# Altium schematic sheet 1.SchDoc
size A4
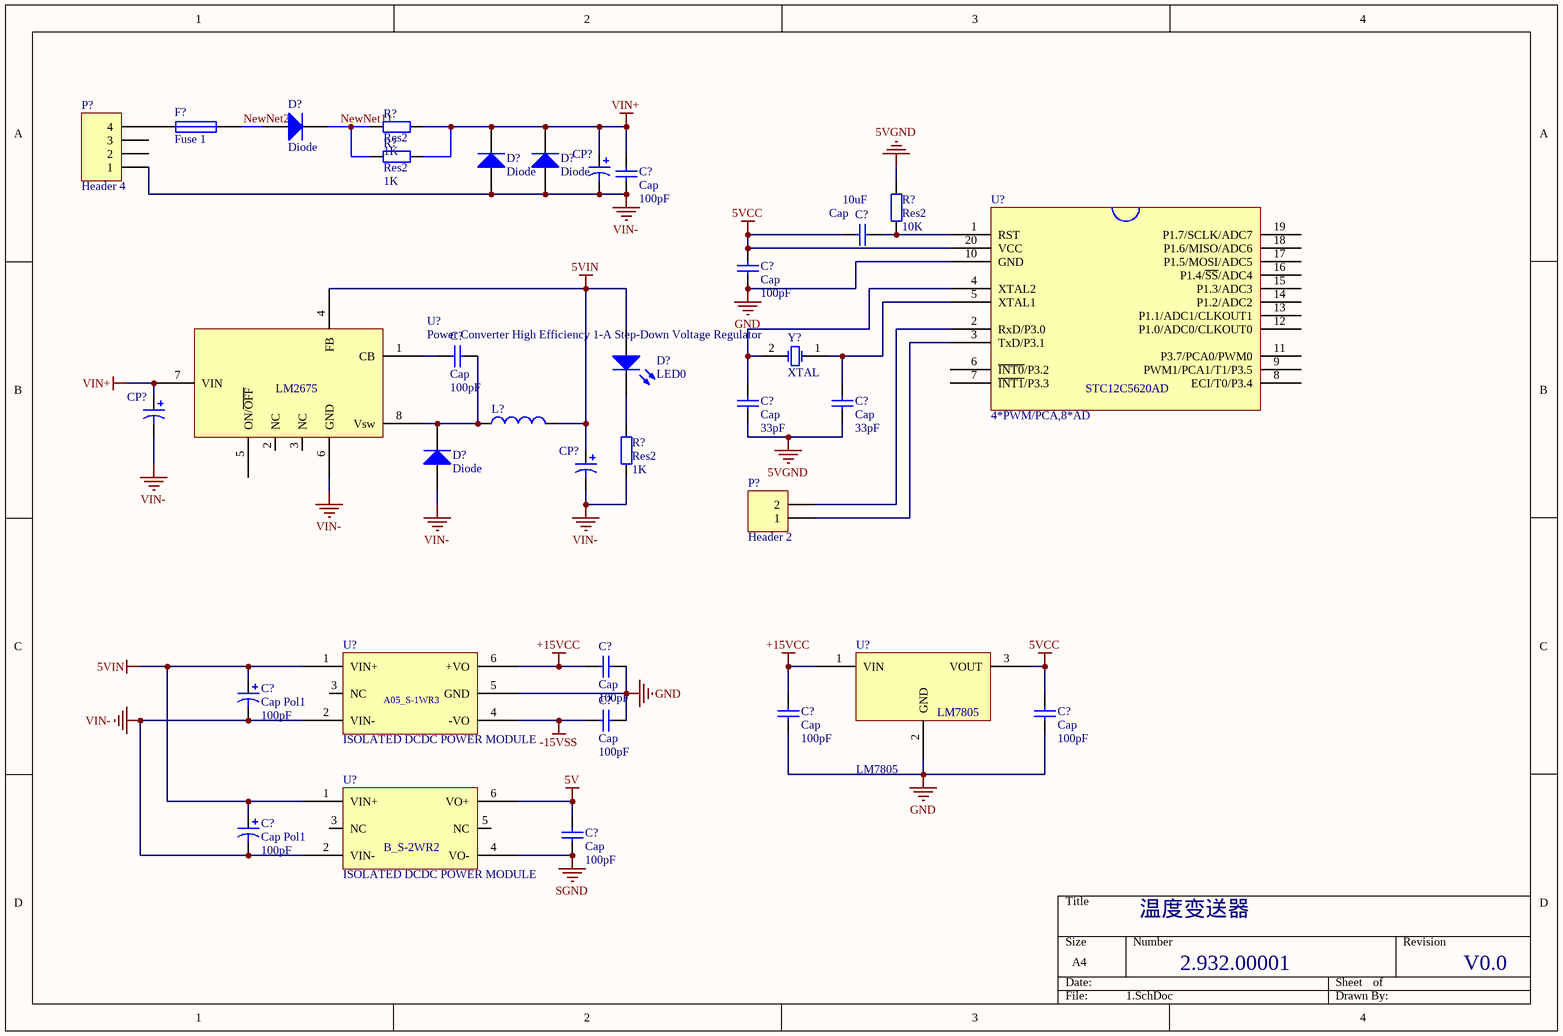
[diagram p0: 1.SchDoc]

## Parts
(Parts that share a designator on the sheet are numbered #1, #2 ... from top to bottom, then left to right.)
C?#1  Cap  value 100pF  [RAD-0.3]
C?#2  Cap  value 10uF  [RAD-0.3]
C?#3  Cap  value 100pF  [RAD-0.3]
C?#4  Cap  value 100pF  [RAD-0.3]
C?#5  Cap  value 33pF  [RAD-0.3]
C?#6  Cap  value 33pF  [RAD-0.3]
C?#7  Cap  value 100pF  [RAD-0.3]
C?#8  Cap Pol1  value 100pF  [RB7.6-15]
C?#9  Cap  value 100pF  [RAD-0.3]
C?#10  Cap  value 100pF  [RAD-0.3]
C?#11  Cap  value 100pF  [RAD-0.3]
C?#12  Cap Pol1  value 100pF  [RB7.6-15]
C?#13  Cap  value 100pF  [RAD-0.3]
CP?#1  Comment  [CAP 3.5*8*11.5]  (value not drawn)
CP?#2  Comment  [CAP 3.5*8*11.5]  (value not drawn)
CP?#3  Comment  [CAP 3.5*8*11.5]  (value not drawn)
D?#1  Diode  [SMC]
D?#2  Diode  [SMC]
D?#3  Diode  [SMC]
D?#4  LED0  [LED-0]
D?#5  Diode  [SMC]
F?  Fuse 1  [PIN-W2/E2.8]
L?  Comment  [PK0810]  (value not drawn)
P?#1  Header 4  [HDR1X4]
P?#2  Header 2  [HDR1X2]
R?#1  Res2  value 1K  [AXIAL-0.4]
R?#2  Res2  value 1K  [AXIAL-0.4]
R?#3  Res2  value 10K  [AXIAL-0.4]
R?#4  Res2  value 1K  [AXIAL-0.4]
U?#1  4*PWM/PCA,8*AD
U?#2  Power Converter High Efficiency 1-A Step-Down Voltage Regulator
U?#3  LM7805
U?#4  ISOLATED DCDC POWER MODULE
U?#5  ISOLATED DCDC POWER MODULE
Y?  XTAL  [R38]

## Nets
5V: C?#13.1 U?#5.6(VO+)
5VCC: C?#2.1 C?#3.1 C?#11.1 U?#1.20(VCC) U?#3.3(VOUT)
5VGND: C?#5.2 C?#6.2 R?#3.2
5VIN: C?#8.1 C?#12.1 CP?#3.1 D?#4.1(A) L?.2 U?#2.4(FB) U?#4.1(VIN+) U?#5.1(VIN+)
+15VCC: C?#7.1 C?#10.1 U?#3.1(VIN) U?#4.6(+VO)
-15VSS: C?#9.1 U?#4.4(-VO)
GND: C?#3.2 C?#7.2 C?#9.2 C?#10.2 C?#11.2 U?#1.10(GND) U?#3.2(GND) U?#4.5(GND)
SGND: C?#13.2 U?#5.4(VO-)
VIN+: C?#1.1 CP?#1.1 CP?#2.1 D?#2.2(K) D?#3.2(K) R?#1.1 R?#2.1 U?#2.7(VIN)
VIN-: C?#1.2 C?#8.2 C?#12.2 CP?#1.2 CP?#2.2 CP?#3.2 D?#2.1(A) D?#3.1(A) D?#5.1(A) P?#1.1 R?#4.1 U?#2.6(GND) U?#4.2(VIN-) U?#5.2(VIN-)
NewNet2: D?#1.1(A) F?.2
NewNet11: D?#1.2(K) R?#1.2 R?#2.2
NetC?#2_2: C?#2.2 R?#3.1 U?#1.1(RST)
NetC?#4_1: C?#4.1 U?#2.1(CB)
NetC?#4_2: C?#4.2 D?#5.2(K) L?.1 U?#2.8(Vsw)
NetC?#5_1: C?#5.1 U?#1.4(XTAL2) Y?.2(OSC2)
NetC?#6_1: C?#6.1 U?#1.5(XTAL1) Y?.1(OSC1)
NetD?#4_2: D?#4.2(K) R?#4.2
NetF?_1: F?.1 P?#1.4
NetP?#2_1: P?#2.1 U?#1.3(TxD/P3.1)
NetP?#2_2: P?#2.2 U?#1.2(RxD/P3.0)

Not connected (* = marked no-connect by the designer): P?#1 2 3; U?#1 6(~{INT0}/P3.2) 7(~{INT1}/P3.3) 8(ECI/T0/P3.4) 9(PWM1/PCA1/T1/P3.5) 11(P3.7/PCA0/PWM0) 12(P1.0/ADC0/CLKOUT0) 13(P1.1/ADC1/CLKOUT1) 14(P1.2/ADC2) 15(P1.3/ADC3) 16(P1.4/~{SS}/ADC4) 17(P1.5/MOSI/ADC5) 18(P1.6/MISO/ADC6) 19(P1.7/SCLK/ADC7); U?#2 2(NC) 3(NC) 5(ON/~{OFF}); U?#4 3(NC); U?#5 3(NC) 5(NC)

## Notes on the sheet
- 温度变送器
- 2.932.00001
- V0.0

## Library data of the parts
C?#1-C?#7 C?#9-C?#11 C?#13 = Cap: Capacitor; Published: 8-Jun-2000; LatestRevisionDate: 17-Jul-2002; LatestRevisionNote: Re-released for DXP Platform.; PackageReference: RAD-0.3; Publisher: Altium Limited; PackageDescription: Radial Cap, Thru-Hole; 2 Leads; 0.3 in Pin Spacing
C?#8 C?#12 = Cap Pol1: Polarized Capacitor (Radial); Published: 8-Jun-2000; LatestRevisionDate: 17-Jul-2002; LatestRevisionNote: Re-released for DXP Platform.; PackageReference: RB7.6-15; Publisher: Altium Limited; PackageDescription: Polarized Capacitor (Radial); 2 Leads
CP?#1-CP?#3 = Cap Pol3: Value: 50V100UF
D?#1-D?#3 D?#5 = Diode: Default Diode; Published: 8-Jun-2000; LatestRevisionDate: 17-Jul-2002; LatestRevisionNote: Re-released for DXP Platform.; PackageVersion: Sep-1996; PackageReference: SMC; Publisher: Altium Limited; PackageDescription: DO-214-AB/SMC; 2 C-Bend Leads; Body 7.9 x 5.9 mm, inc. leads (LxW); Code_JEDEC: DO-214-AB
D?#4 = LED0: Typical INFRARED GaAs LED; Published: 8-Jun-2000; LatestRevisionDate: 08-Jul-2005; LatestRevisionNote: Mech Layer 1 removed.; PackageReference: LED-0; Publisher: Altium Limited; PackageDescription: LED; 2 Leads
F? = Fuse 1: Fuse; Published: 8-Jun-2000; LatestRevisionDate: 17-Jul-2002; LatestRevisionNote: Re-released for DXP Platform.; PackageReference: PIN-W2/E2.8; Publisher: Altium Limited; PackageDescription: Thru-Hole; 2 Leads
L? = Inductor: Value: 47uH
P?#1 = Header 4: Header, 4-Pin; LatestRevisionDate: 17-Jul-2002; LatestRevisionNote: Re-released for DXP Platform.; Publisher: Altium Limited
P?#2 = Header 2: Header, 2-Pin; LatestRevisionDate: 17-Jul-2002; LatestRevisionNote: Re-released for DXP Platform.; Publisher: Altium Limited
R?#1-R?#4 = Res2: Resistor; Published: 8-Jun-2000; LatestRevisionDate: 17-Jul-2002; LatestRevisionNote: Re-released for DXP Platform.; PackageReference: AXIAL-0.4; Publisher: Altium Limited; PackageDescription: Axial Device, Thru-Hole; 2 Leads; 0.4 in Pin Spacing
U?#1 = STC12C5620AD
U?#2 = LM2675
U?#4 = A05_S-1WR3
U?#5 = B_S-2WR2
Y? = XTAL: Crystal Oscillator; Published: 8-Jun-2000; LatestRevisionDate: 17-Jul-2002; LatestRevisionNote: Re-released for DXP Platform.; PackageReference: R38; Publisher: Altium Limited; PackageDescription: Crystal, Thru-Hole; 2 Leads; Body 3.1 x 8.2 mm (Dia.xH)